# Altium schematic sheet VNA_7.SchDoc: VNA
size 409 x 289 mm; Origin: Eagle; OriginPath: C:\Users\Ground Lab\Desktop\LibreVNA\Hardware\Eagle\VNA.sch; OriginSheet: 8; OriginDescription: Ref Signal; Date: 04.05.2025 20:03:37; SheetNumber: 8; GateName_1: G$1; SymbolName_1: A3L-LOC; LibraryName: VNA; DeviceSetName: A3L-LOC; Sheet: Sheet:
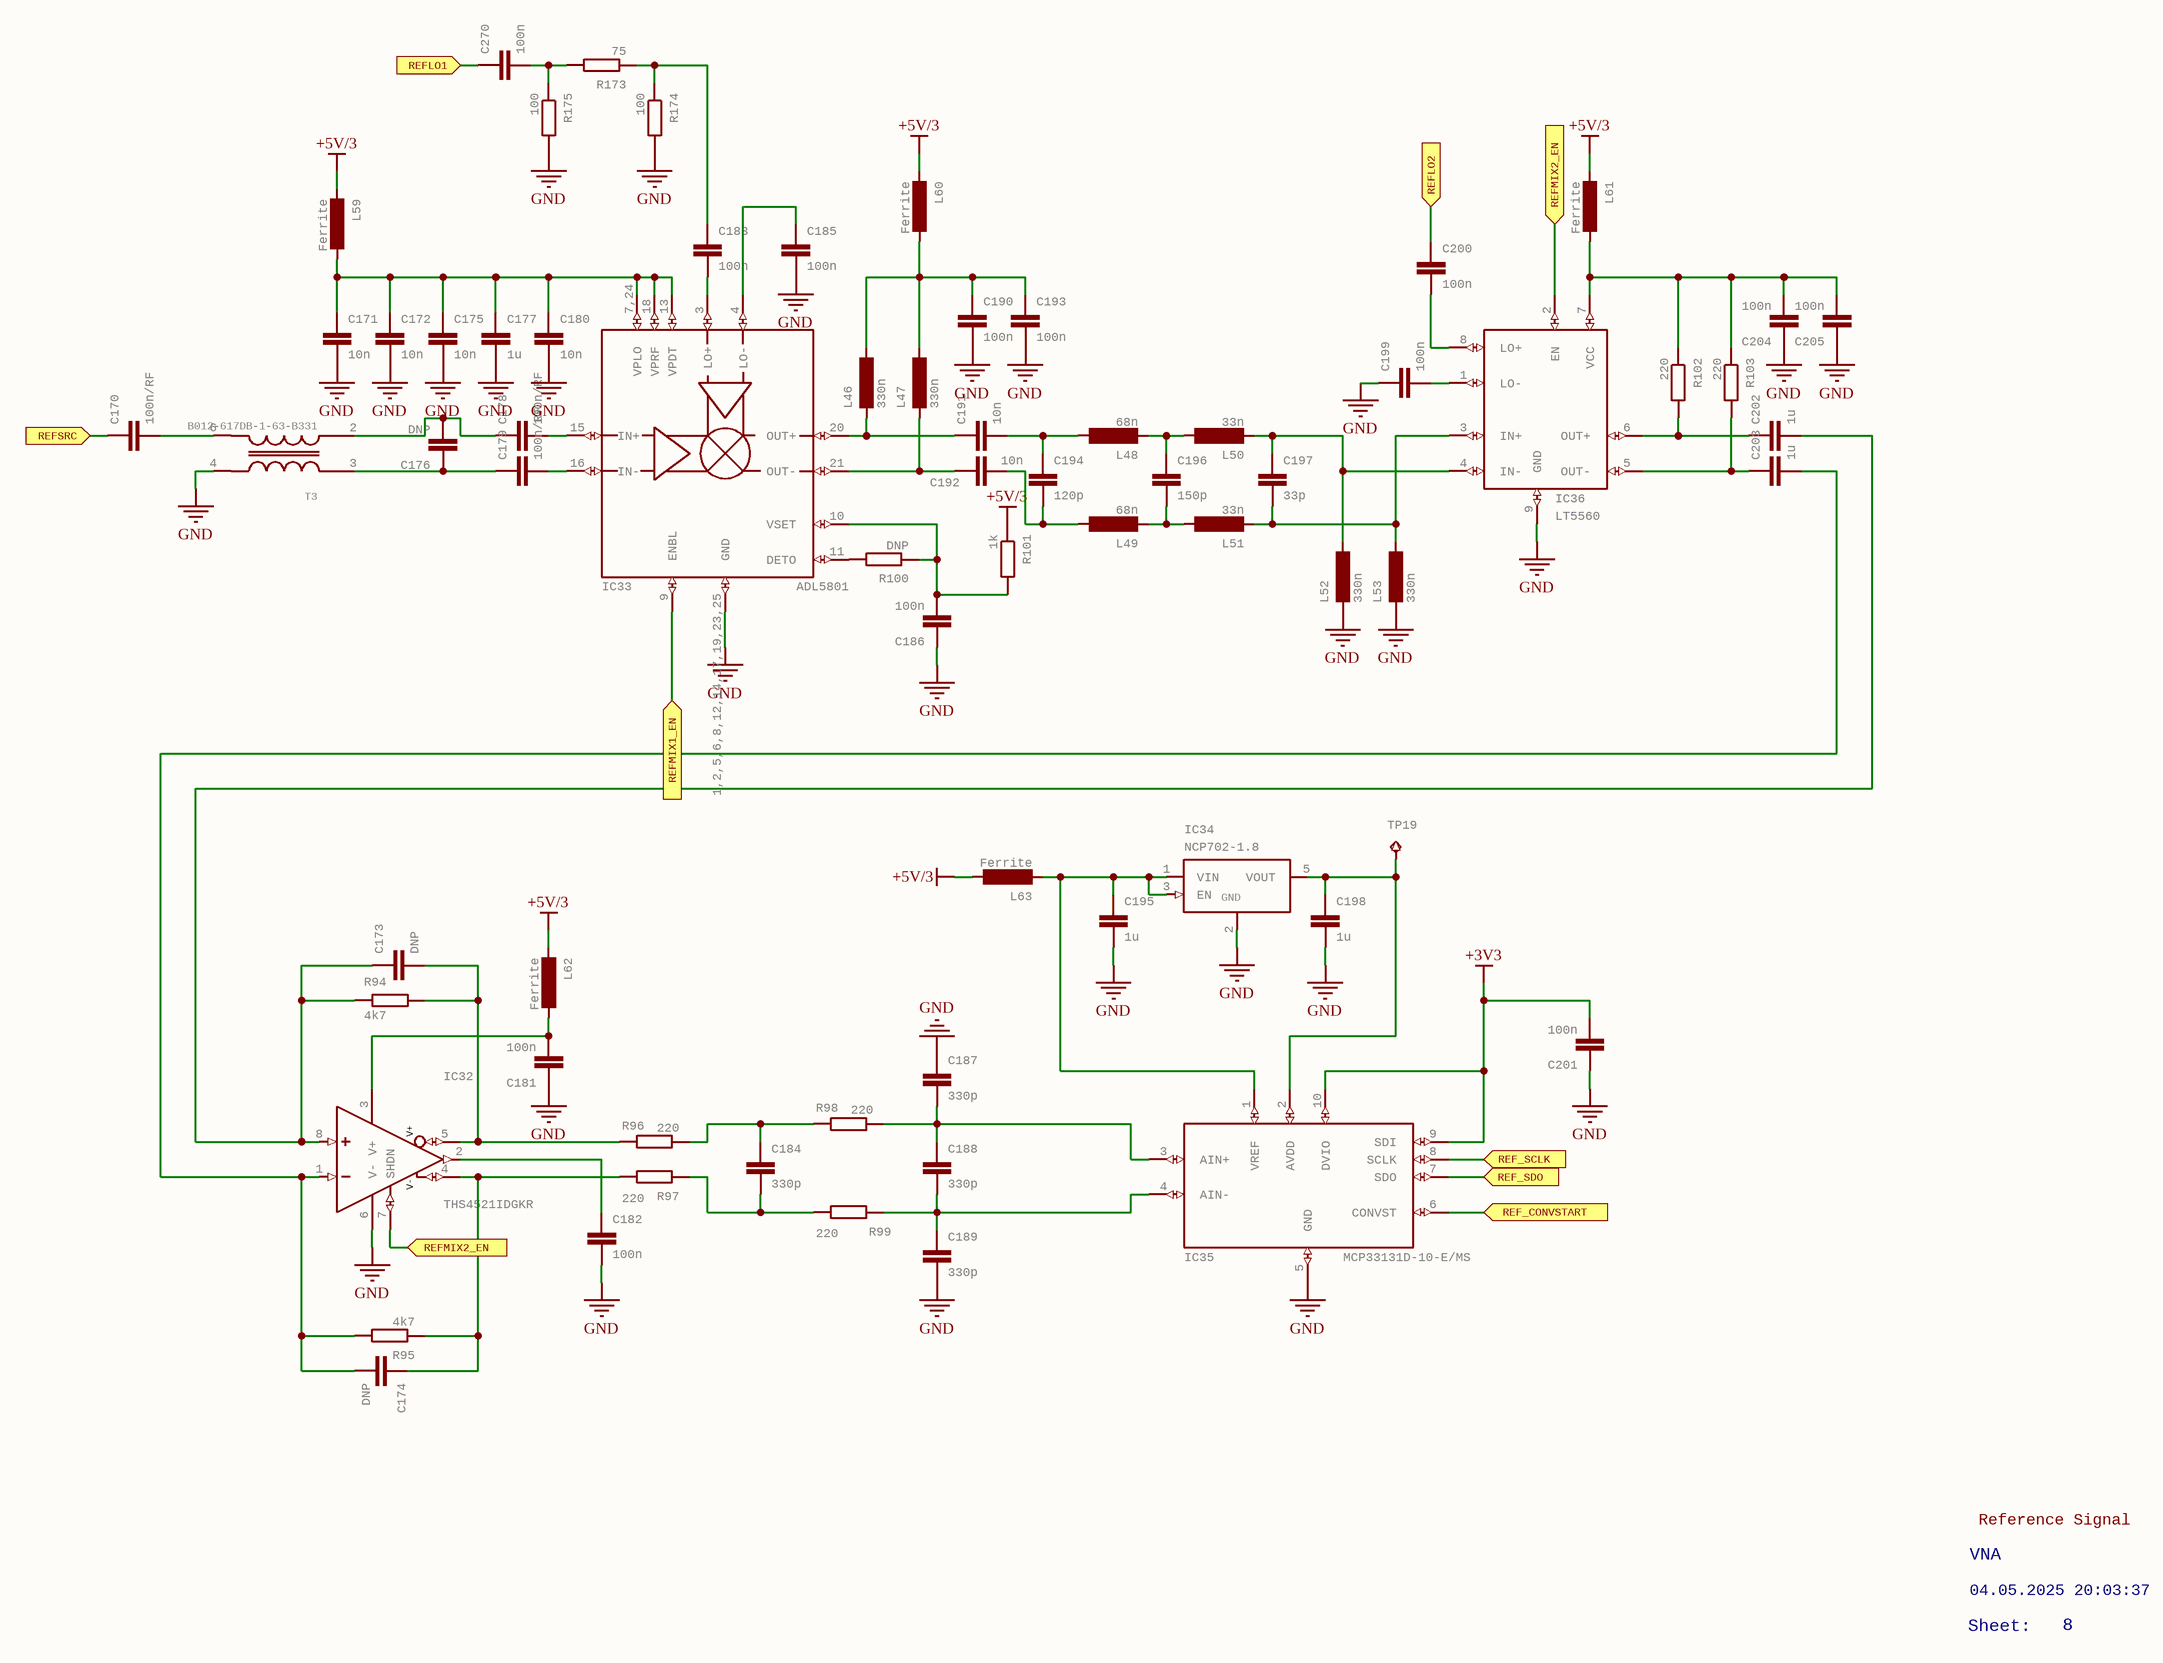
[diagram p0: VNA_7.SchDoc]

## Parts
C170  100n/RF  [C0402]
C171  10n  [C0402]
C172  10n  [C0402]
C173  DNP  [C0402]
C174  DNP  [C0402]
C175  10n  [C0402]
C176  DNP  [C0402]
C177  1u  [C0402]
C178  100n/RF  [C0402]
C179  100n/RF  [C0402]
C180  10n  [C0402]
C181  100n  [C0402]
C182  100n  [C0402]
C183  100n  [C0402]
C184  330p  [C0402]
C185  100n  [C0402]
C186  100n  [C0402]
C187  330p  [C0402]
C188  330p  [C0402]
C189  330p  [C0402]
C190  100n  [C0402]
C191  10n  [C0402]
C192  10n  [C0402]
C193  100n  [C0402]
C194  120p  [C0402]
C195  1u  [C0402]
C196  150p  [C0402]
C197  33p  [C0402]
C198  1u  [C0402]
C199  100n  [C0402]
C200  100n  [C0402]
C201  100n  [C0402]
C202  1u  [C0402]
C203  1u  [C0402]
C204  100n  [C0402]
C205  100n  [C0402]
C270  100n  [C0402]
IC32  THS4521IDGKR  [SOP65P490X110-8N]
IC33  ADL5801  [QFN50P400X400X100-25T250N]
IC34  NCP702-1.8  [SOT95P240X110-5]
IC35  MCP33131D-10-E/MS  [SOP50P490X110-10N]
IC36  LT5560  [SON50P300X300X80-9T165X238]
L46  330n  [L0402]
L47  330n  [L0402]
L48  68n  [L0402]
L49  68n  [L0402]
L50  33n  [L0402]
L51  33n  [L0402]
L52  330n  [L0402]
L53  330n  [L0402]
L59  Ferrite  [R0402]
L60  Ferrite  [R0402]
L61  Ferrite  [R0402]
L62  Ferrite  [R0402]
L63  Ferrite  [R0402]
R94  4k7  [R0402]
R95  4k7  [R0402]
R96  220  [R0402]
R97  220  [R0402]
R98  220  [R0402]
R99  220  [R0402]
R100  DNP  [R0402]
R101  1k  [R0402]
R102  220  [R0402]
R103  220  [R0402]
R173  75  [R0402]
R174  100  [R0402]
R175  100  [R0402]
T3  B012-617DB-1-63-B331  [EASTEVER_BALUN]
TP19  TPB1,27  [B1,27]  (value not drawn)

## Ports
REF_CONVSTART (in), REF_SCLK (in), REF_SDO (in), REFLO1 (in), REFLO2 (in), REFMIX1_EN (in), REFMIX2_EN (in), REFSRC (in)

## Nets
+3V3: C201.2 IC35.9(SDI) IC35.10(DVIO)
+5V/3: L59.2 L60.2 L61.2 L62.2 L63.1 R101.1
GND: C171.2 C172.2 C175.2 C177.2 C180.2 C181.1 C182.2 C185.2 C186.1 C187.1 C189.2 C190.2 C193.2 C195.2 C198.2 C199.1 C201.1 C204.1 C205.1 IC32.6(V-) IC33.1,2,5,6,8,12,14,17,19,23,25(GND) IC34.2(GND) IC35.5(GND) IC36.9(GND) L52.2 L53.2 R174.2 R175.2 T3.4(OUT+)
REF_CONVSTART: IC35.6(CONVST) ; port REF_CONVSTART
REF_SCLK: IC35.8(SCLK) ; port REF_SCLK
REF_SDO: IC35.7(SDO) ; port REF_SDO
REFLO1: C270.1 ; port REFLO1
REFLO2: C200.1 ; port REFLO2
REFMIX1_EN: IC33.9(ENBL) ; port REFMIX1_EN
REFMIX2_EN: IC32.7(SHDN) IC36.2(EN) ; port REFMIX2_EN
REFSRC: C170.1 ; port REFSRC
NetC170_2: C170.2 T3.6(OUT-)
NetC171_1: C171.1 C172.1 C175.1 C177.1 C180.1 IC33.7,24(VPLO) IC33.13(VPDT) IC33.18(VPRF) L59.1
NetC173_1: C173.1 C202.2 IC32.8(+IN) R94.1
NetC173_2: C173.2 IC32.5(-OUT) R94.2 R96.2
NetC174_1: C174.1 IC32.4(+OUT) R95.1 R97.2
NetC174_2: C174.2 C203.2 IC32.1(-IN) R95.2
NetC176_1: C176.1 C179.1 T3.3(IN+)
NetC176_2: C176.2 C178.1 T3.2(IN-)
NetC178_2: C178.2 IC33.15(IN+)
NetC179_2: C179.2 IC33.16(IN-)
NetC181_2: C181.2 IC32.3(V+) L62.1
NetC182_1: C182.1 IC32.2(VOCM)
NetC183_1: C183.1 R173.1 R174.1
NetC183_2: C183.2 IC33.3(LO+)
NetC184_1: C184.1 R96.1 R98.2
NetC184_2: C184.2 R97.1 R99.2
NetC185_1: C185.1 IC33.4(LO-)
NetC186_2: C186.2 IC33.10(VSET) R100.1 R101.2
NetC187_2: C187.2 C188.1 IC35.3(AIN+) R98.1
NetC188_2: C188.2 C189.1 IC35.4(AIN-) R99.1
NetC190_1: C190.1 C193.1 L46.1 L47.1 L60.1
NetC191_1: C191.1 IC33.20(OUT+) L46.2
NetC191_2: C191.2 C194.1 L48.1
NetC192_1: C192.1 IC33.21(OUT-) L47.2
NetC192_2: C192.2 C194.2 L49.1
NetC195_1: C195.1 IC34.1(VIN) IC34.3(EN) IC35.1(VREF) L63.2
NetC196_1: C196.1 L48.2 L50.1
NetC196_2: C196.2 L49.2 L51.1
NetC197_1: C197.1 C197.2 IC36.3(IN+) IC36.4(IN-) L50.2 L51.2 L52.1 L53.1
NetC198_1: C198.1 IC34.5(VOUT) IC35.2(AVDD) TP19.TP
NetC199_2: C199.2 IC36.1(LO-)
NetC200_2: C200.2 IC36.8(LO+)
NetC202_1: C202.1 IC36.6(OUT+) R102.2
NetC203_1: C203.1 IC36.5(OUT-) R103.2
NetC204_2: C204.2 C205.2 IC36.7(VCC) L61.1 R102.1 R103.1
NetC270_2: C270.2 R173.2 R175.1
NetIC33_11: IC33.11(DETO) R100.2

## Notes on the sheet
- VNA
- Reference Signal
- Sheet:
- 04.05.2025 20:03:37
- 8

## Library data of the parts
C170-C205 C270 = C-EU*?:2C0402: CAPACITOR, European symbol; GateName_1: G$1; SymbolName_1: C-EU:1; DeviceName: C0402; LibraryName: VNA; DeviceSetName: C-EU*?:2
IC32 = THS4521IDGKR: GateName_1: G$1; SymbolName_1: OPAMPDIFF_SHDN; LibraryName: VNA; DeviceSetName: THS4521IDGKR; V+: V+; V-: V-
IC33 = ADL5801: GateName_1: G$1; SymbolName_1: ADL5801; LibraryName: VNA; DeviceSetName: ADL5801
IC34 = NCP702: GateName_1: G$1; SymbolName_1: VREG_EN; LibraryName: VNA; DeviceSetName: NCP702; GND: GND
IC35 = MCP33131D-10-E/MS: GateName_1: G$1; SymbolName_1: MCP33131D-10-E/MS; LibraryName: VNA; DeviceSetName: MCP33131D-10-E/MS
IC36 = LT5560: GateName_1: G$1; SymbolName_1: LT5560; LibraryName: VNA; DeviceSetName: LT5560
L46-L53 = INDUCTOR0402: GateName_1: G$1; SymbolName_1: L-EU:1; DeviceName: 0402; LibraryName: VNA; DeviceSetName: INDUCTOR
L59-L63 = FERRITE: GateName_1: G$1; SymbolName_1: L-EU:1; LibraryName: VNA; DeviceSetName: FERRITE
R94-R103 R173-R175 = R-EU_R0402: RESISTOR, European symbol; GateName_1: G$1; SymbolName_1: R-EU; DeviceSetName: R-EU_; DeviceName: R0402; LibraryName: VNA
T3 = B012-617DB-1-63-B331: GateName_1: G$1; SymbolName_1: BALUN_1:1; LibraryName: VNA; DeviceSetName: B012-617DB-1-63-B331
TP19 = TPB1,27: Test pad; GateName_1: G$1; SymbolName_1: TP; DeviceName: B1,27; LibraryName: VNA; DeviceSetName: TP